# EAGLE design CatFeeder-Drive (EAGLE 7.4.0)
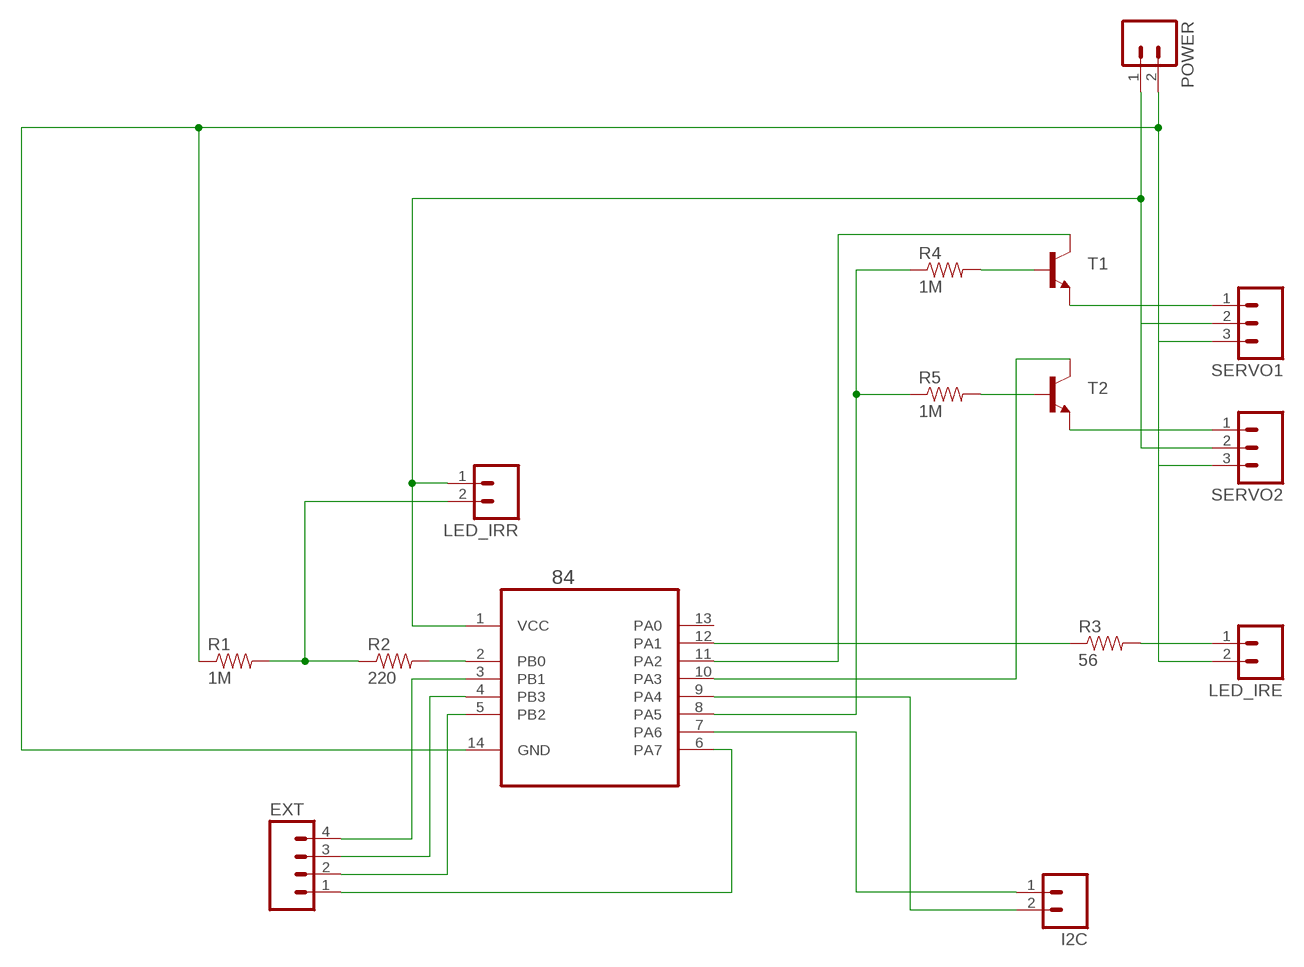
[diagram p0: schematic, sheet 1]

## Parts
84  ATTINY84-20PU  [DIP254P762X533-14]
EXT  M041X04_NO_SILK  [1X04_NO_SILK]
I2C  M02PTH  [1X02]
LED_IRE  M02LOCK  [1X02_LOCK]
LED_IRR  M02LOCK  [1X02_LOCK]
POWER  M02LOCK  [1X02_LOCK]
R1  1M  RESISTORPTH-1/4W  [AXIAL-0.4]
R2  220  RESISTORPTH-1/4W  [AXIAL-0.4]
R3  56  RESISTORPTH-1/4W  [AXIAL-0.4]
R4  1M  RESISTORPTH-1/4W  [AXIAL-0.4]
R5  1M  RESISTORPTH-1/4W  [AXIAL-0.4]
SERVO1  M031X03_NO_SILK  [1X03_NO_SILK]
SERVO2  M031X03_NO_SILK  [1X03_NO_SILK]
T1  TRANSISTOR_NPNBC547  [TO-92-AMMO]
T2  TRANSISTOR_NPNBC547  [TO-92-AMMO]

## Nets
$N$8: 84.11(PA2) T1.1(C)
LED_IRR: 84.1(VCC) LED_IRR.1 POWER.1 SERVO1.2 SERVO2.2
N$1: 84.9(PA4) I2C.2
N$2: 84.7(PA6) I2C.1
N$3: 84.8(PA5) R4.P$1 R5.P$1
N$4: R4.P$2 T1.2(B)
N$5: R5.P$2 T2.2(B)
N$6: 84.3(PB1) EXT.4
N$7: 84.10(PA3) T2.1(C)
N$8: SERVO1.1 T1.3(E)
N$9: SERVO2.1 T2.3(E)
N$10: 84.2(PB0) R2.P$2
N$11: 84.12(PA1) R3.P$1
N$12: 84.4(PB3) EXT.3
N$13: LED_IRE.1 R3.P$2
N$14: 84.5(PB2) EXT.2
N$15: LED_IRR.2 R1.P$2 R2.P$1
N$16: 84.14(GND) LED_IRE.2 POWER.2 R1.P$1 SERVO1.3 SERVO2.3
N$17: 84.6(PA7) EXT.1
Unconnected: 84.13(PA0)

## Library data of the parts
84 = Atmel_By_element14_Batch_1-00:ATTINY84-20PU: 8-bit Microcontroller with In-System Programmable Flash; MPN: ATTINY84-20PU; OC_FARNELL: -; OC_NEWARK: 58M3794; PACKAGE: PDIP-14; SUPPLIER: Atmel
EXT = SparkFun-Connectors:M04: Header 4 Standard 4-pin 0.1" header. Use with straight break away headers (SKU : PRT-00116), right angle break away headers (PRT-00553), swiss pins (PRT-00743), machine pins (PRT-00117), and female headers (PRT-00115). Molex polarized connector foot print use with SKU : PRT-08231 with associated crimp pins and housings. 1MM SMD Version SKU: PRT-10208
I2C LED_IRE LED_IRR POWER = SparkFun-Connectors:M02: Standard 2-pin 0.1" header. Use with - straight break away headers ( PRT-00116) - right angle break away headers (PRT-00553) - swiss pins (PRT-00743) - machine pins (PRT-00117) - female headers (PRT-00115) Molex polarized connector foot print use with: PRT-08233 with associated crimp pins and housings. 2.54_SCREWTERM for use with PRT-10571. 3.5mm Screw Terminal footprints for PRT-08084 5mm Screw Terminal footprints for use with PRT-08432
R1-R5 = SparkFun-Resistors:RESISTOR: Resistor Basic schematic elements and footprints for 0603, 1206, and PTH resistors.
SERVO1 SERVO2 = SparkFun-Connectors:M03: Header 3 Standard 3-pin 0.1" header. Use with straight break away headers (SKU : PRT-00116), right angle break away headers (PRT-00553), swiss pins (PRT-00743), machine pins (PRT-00117), and female headers (PRT-00115). Molex polarized connector foot print use with SKU : PRT-08232 with associated crimp pins and housings.
T1 T2 = SparkFun-DiscreteSemi:TRANSISTOR_NPN: Generic NPN BJT MMBT2222A - TRANS-08049 (SOT-23, 1A 40V) MPSA42 - TRANS-09116 (SOT-23, 500mA 300V) MMBT5088LT1G - TRANS-11160 (SOT-23, 50 mA 30V) BC547 - COM-08928 <http://www.sparkfun.com/products/8928> (TO-92 45V 100mA) (1.Collector 2.Base 3.Emitter) 2N3904 - COM-00521 <http://www.sparkfun.com/products/521> (TO-92 40V 200mA) (1.Emitter 2.Base 3.Collector) P2N2222A - COM-12852 <http://www.sparkfun.com/products/12852> (TO-92 40V 600mA) (1.Collector 2.Base 3.Emitter)

## Board
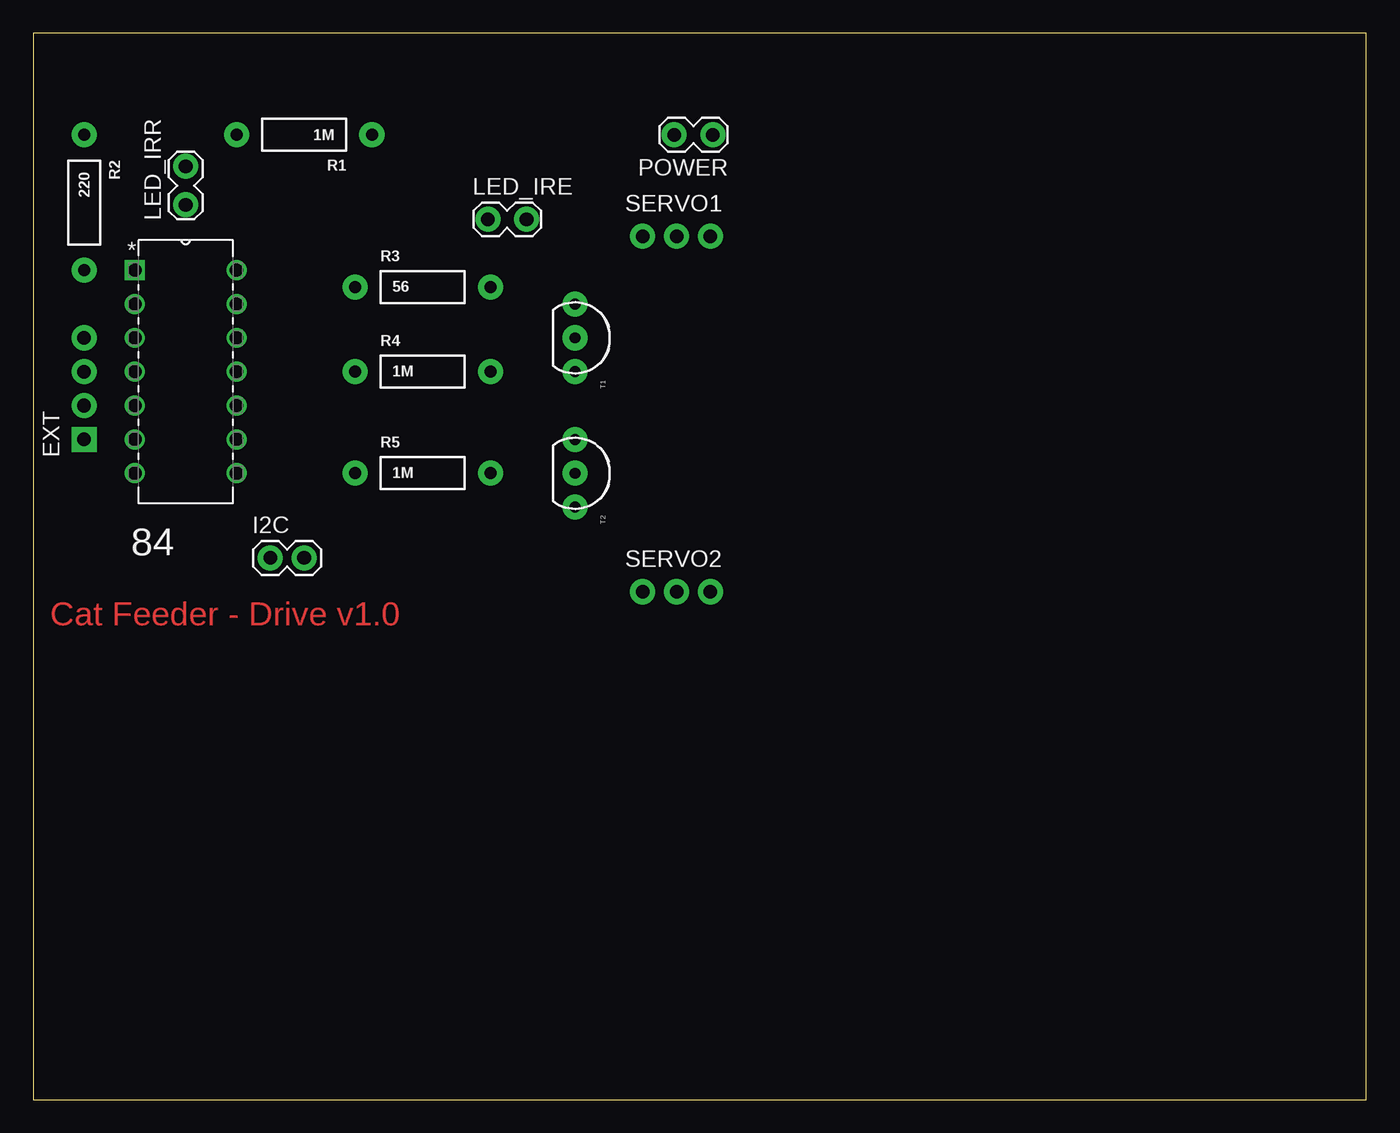
[diagram p1: board, top side]
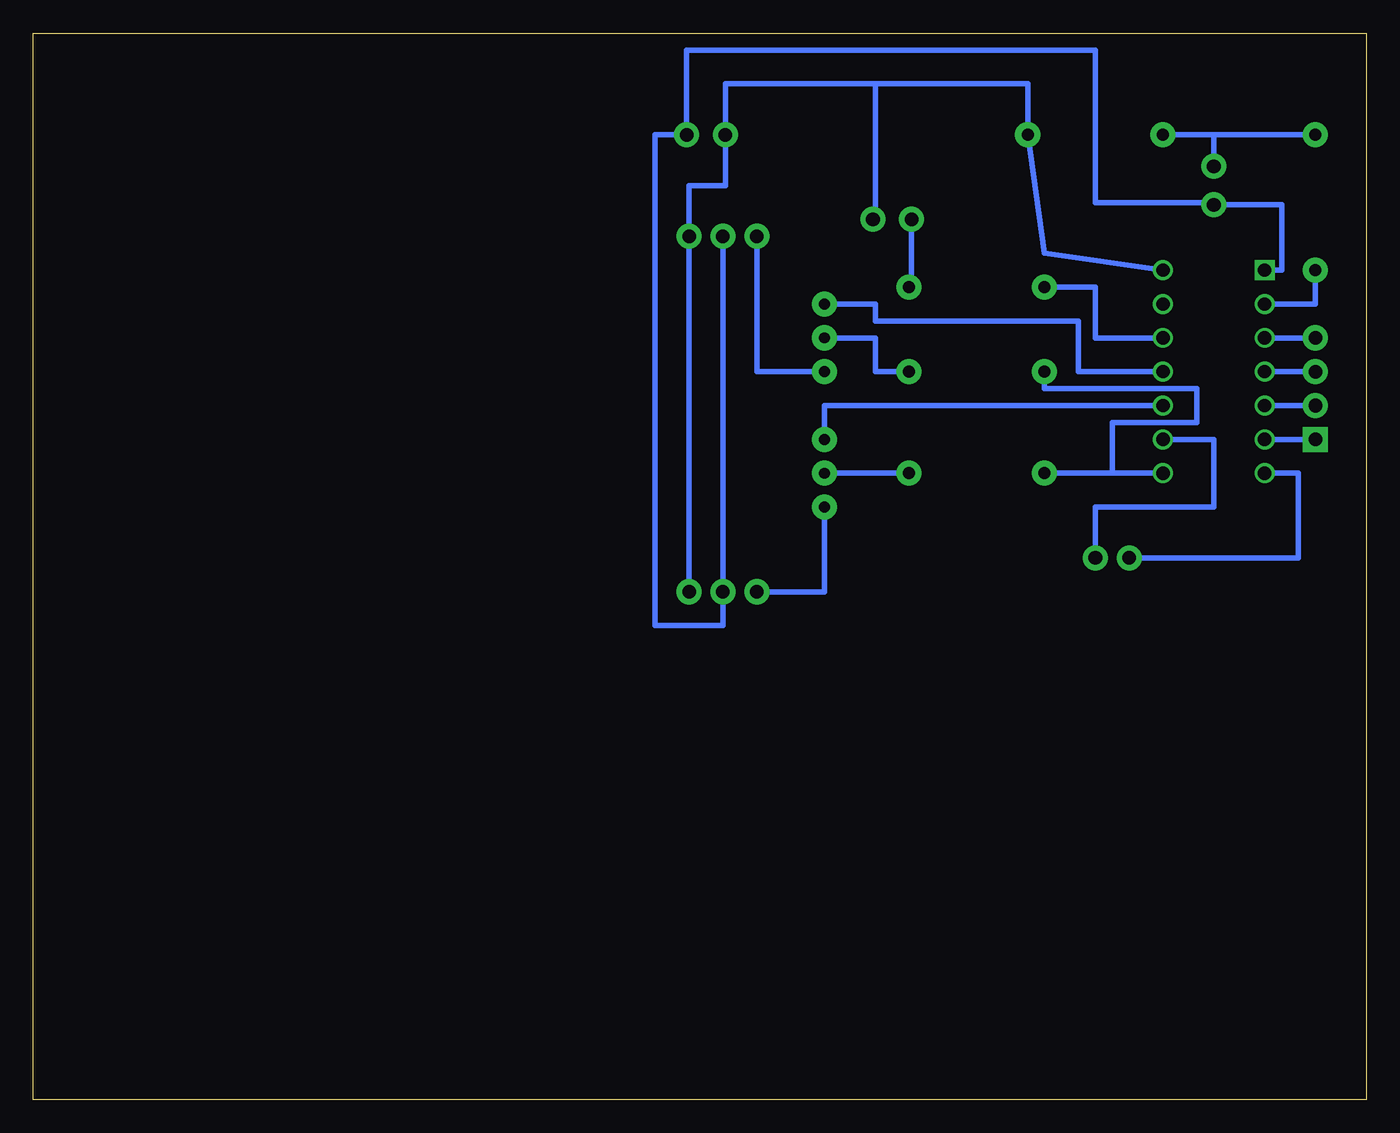
[diagram p2: board, bottom side, seen from below]

Size 100 x 80 mm. Coordinates in mm from the lower left corner, seen from the top.
Outline: 0,0 100,0 100,80 0,80 0,0
Copper layers (1*16): Top 0.035mm / dielectric 1.5mm / Bottom 0.035mm
Design rules "default": minimum track width 10mil, minimum drill 24mil, track to track 8mil, track to pad 8mil, pad to pad 8mil, via to via 8mil, smd to smd 8mil, copper to edge 40mil, drill to drill 8mil, minimum pad ring 10mil, minimum via ring 8mil, stop-mask expansion 4mil, vias tented up to drill 0mil, thermal gap 10mil

### Footprints (pad centres in the part's own frame; a part is rotated, then mirrored left to right if it is on the bottom)
DIP254P762X533-14 = drill 0.991 square: 1 -7.62,15.24 | drill 0.991: 2 -7.62,12.7; 3 -7.62,10.16; 4 -7.62,7.62; 5 -7.62,5.08; 6 -7.62,2.54; 7 -7.62,0; 8 0,0; 9 0,2.54; 10 0,5.08; 11 0,7.62; 12 0,10.16; 13 0,12.7; 14 0,15.24
1X04_NO_SILK = drill 1.016 pad 1.88 square: 1 0,0 | drill 1.016 pad 1.88: 2 2.54,0; 3 5.08,0; 4 7.62,0
1X02 = drill 1.016 pad 1.88: 1 0,0; 2 2.54,0
1X02_LOCK = drill 1.016 pad 1.88: 1 -0.178,0; 2 2.718,0
AXIAL-0.4 = drill 0.9 pad 1.88: P$1 -5.08,0; P$2 5.08,0
1X03_NO_SILK = drill 1.016 pad 1.88: 1 0,0; 2 2.54,0; 3 5.08,0
TO-92-AMMO = drill 0.813 pad 1.88: 1 -2.54,0; 2 0,0; 3 2.54,0

### Placement (x,y rotation side)
84  15.24,46.99 0 top
EXT  3.81,49.53 90 top
I2C  17.78,40.64 0 top
LED_IRE  34.29,66.04 0 top
LED_IRR  11.43,67.31 90 top
POWER  50.8,72.39 180 top
R1  20.32,72.39 180 top
R2  3.81,67.31 270 top
R3  29.21,60.96 0 top
R4  29.21,54.61 0 top
R5  29.21,46.99 0 top
SERVO1  45.72,64.77 0 top
SERVO2  45.72,38.1 0 top
T1  40.64,57.15 270 top
T2  40.64,46.99 270 top

### Tracks (layer width: path | path; a pad name or v marks a point on that pad's centre or on a via)
$N$8
  Bottom 0.406: 84.11 21.59,54.61 21.59,58.42 36.83,58.42 36.83,59.69 T1.1
LED_IRR
  Bottom 0.406: 84.1 6.35,62.23 6.35,67.13 LED_IRR.1 11.43,67.31 20.32,67.31 20.32,78.74 50.98,78.74 POWER.1 53.34,72.39 53.34,35.56 48.26,35.56 SERVO2.2 SERVO1.2
N$1
  Bottom 0.406: I2C.2 20.32,44.45 11.43,44.45 11.43,49.53 84.9
N$2
  Bottom 0.406: 84.7 5.08,46.99 5.08,40.64 I2C.1
N$3
  Bottom 0.406: 84.8 19.05,46.99 | 19.05,46.99 R5.P$1 | R4.P$1 24.13,53.34 12.7,53.34 12.7,50.8 19.05,50.8 19.05,46.99
N$4
  Bottom 0.406: R4.P$2 36.83,54.61 36.83,57.15 T1.2
N$5
  Bottom 0.406: R5.P$2 T2.2
N$6
  Bottom 0.406: EXT.4 84.3
N$7
  Bottom 0.406: T2.1 40.64,52.07 84.10
N$8
  Bottom 0.406: T1.3 45.72,54.61 SERVO1.1
N$9
  Bottom 0.406: T2.3 40.64,38.1 SERVO2.1
N$10
  Bottom 0.406: 84.2 3.81,59.69 R2.P$2
N$11
  Bottom 0.406: 84.12 20.32,57.15 20.32,60.96 R3.P$1
N$12
  Bottom 0.406: EXT.3 84.4
N$13
  Bottom 0.406: R3.P$2 34.11,60.96 LED_IRE.1
N$14
  Bottom 0.406: EXT.2 84.5
N$15
  Bottom 0.406: R2.P$1 11.43,72.39 | 11.43,72.39 R1.P$2 | LED_IRR.2 11.43,72.39
N$16
  Bottom 0.406: 84.14 24.13,63.5 R1.P$1 25.4,76.2 36.83,76.2 | LED_IRE.2 36.83,66.04 36.83,76.2 | 36.83,76.2 48.08,76.2 POWER.2 | POWER.2 48.26,72.39 | SERVO2.3 SERVO1.3 50.8,68.58 48.08,68.58 POWER.2
N$17
  Bottom 0.406: EXT.1 84.6

### Text on the board
Top: Cat Feeder - Drive v1.0